# Altium schematic sheet Analog_Interface.SchDoc
size C; SheetNumber: 3; SheetTotal: 8
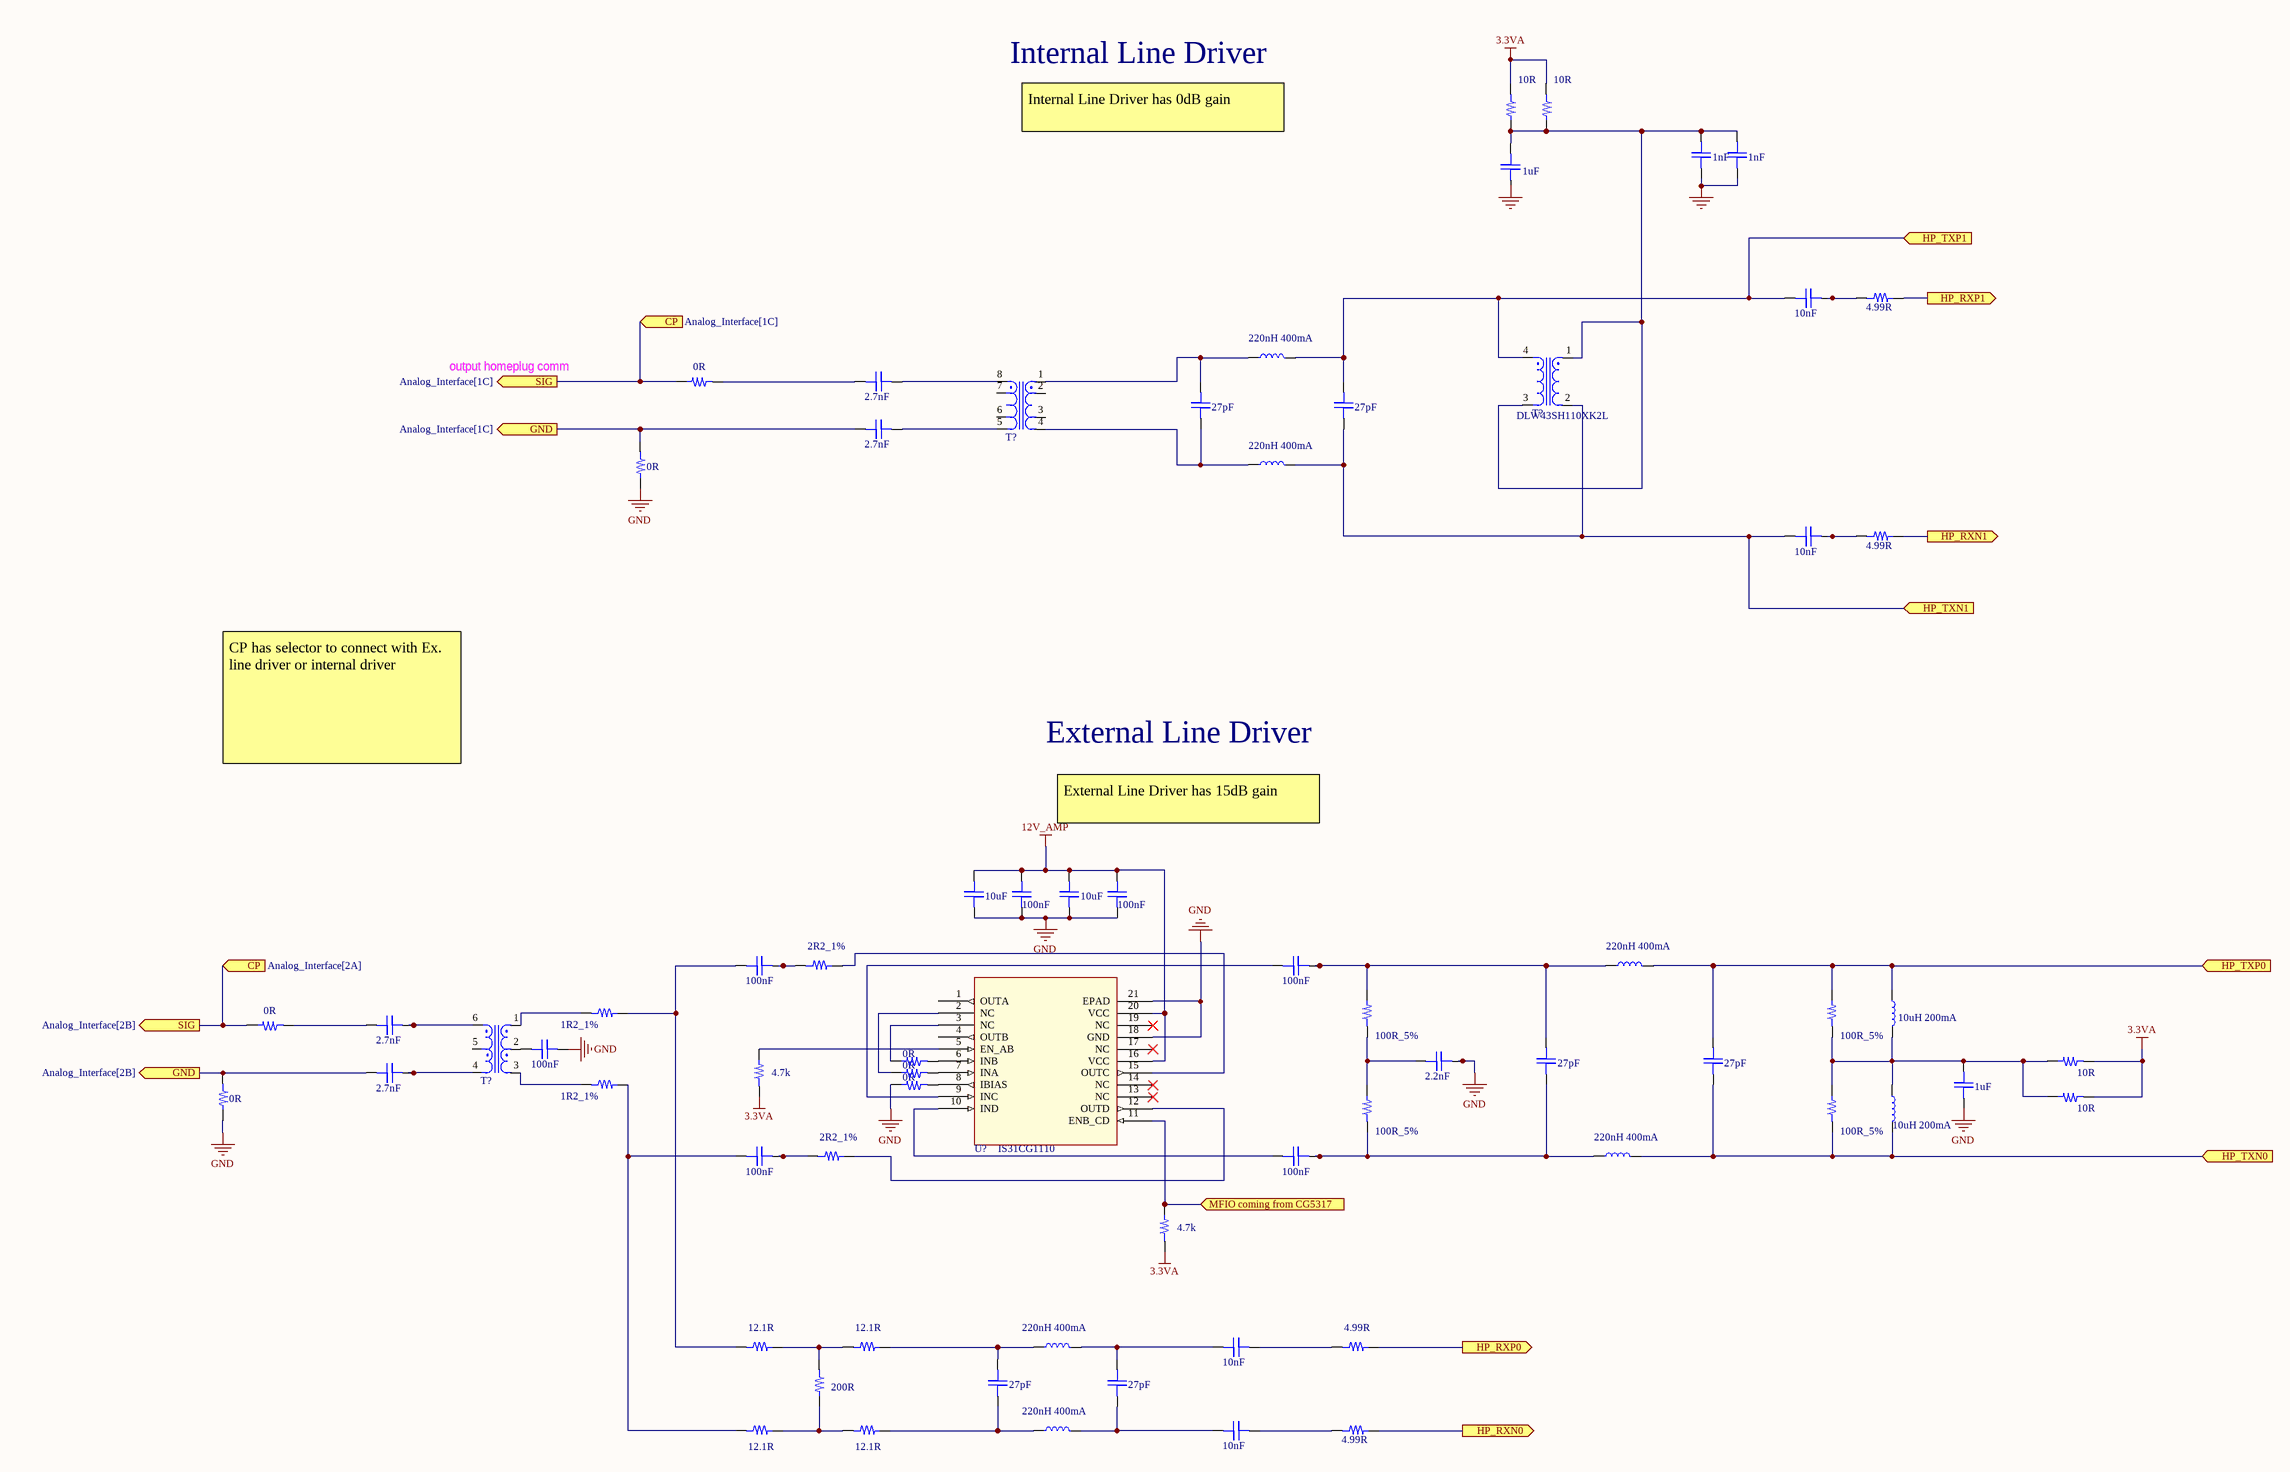
[diagram p0: Analog_Interface.SchDoc]

## Parts
(Parts that share a designator on the sheet are numbered #1, #2 ... from top to bottom, then left to right.)
?#1  10uH 200mA  [L_0805]
?#2  10uH 200mA  [L_0805]
C?#1  1nF  [C0402]
C?#2  1nF  [C0402]
C?#3  1uF  [C0402]
C?#4  10nF  [C0402]
C?#5  2.7nF  [C0402]
C?#6  2.7nF  [C0402]
C?#7  27pF  [C0402]
C?#8  27pF  [C0402]
C?#9  10nF  [C0402]
C?#10  value 10uF  [C0402]  (hidden comment: Capacitor)
C?#11  value 100nF  [C0402]  (hidden comment: Capacitor)
C?#12  value 10uF  [C0402]  (hidden comment: Capacitor)
C?#13  value 100nF  [C0402]  (hidden comment: Capacitor)
C?#14  100nF  [C0402]
C?#15  100nF  [C0402]
C?#16  2.7nF  [C0402]
C?#17  value 100nF  [C0402]  (hidden comment: Capacitor)
C?#18  2.2nF  [C0402]
C?#19  1uF  [C0402]
C?#20  2.7nF  [C0402]
C?#21  27pF  [C0402]
C?#22  27pF  [C0402]
C?#23  100nF  [C0402]
C?#24  100nF  [C0402]
C?#25  10nF  [C0402]
C?#26  27pF  [C0402]
C?#27  27pF  [C0402]
C?#28  10nF  [C0402]
L?#1  220nH 400mA  [L_0805]
L?#2  220nH 400mA  [L_0805]
L?#3  220nH 400mA  [L_0805]
L?#4  220nH 400mA  [L_0805]
L?#5  220nH 400mA  [L_0805]
L?#6  220nH 400mA  [L_0805]
R?#1  10R  [R0402]
R?#2  10R  [R0402]
R?#3  4.99R  [R0402]
R?#4  value 0R  [R0402]  (hidden comment: Resistor)
R?#5  value 0R  [R0402]  (hidden comment: Resistor)
R?#6  4.99R  [R0402]
R?#7  2R2_1%  [R0402]
R?#8  1R2_1%  [R0402]
R?#9  value 0R  [R0402]  (hidden comment: Resistor)
R?#10  100R_5%  [R0402]
R?#11  100R_5%  [R0402]
R?#12  value 0R  [R0402]  (hidden comment: Resistor)
R?#13  10R  [R0402]
R?#14  value 0R  [R0402]  (hidden comment: Resistor)
R?#15  value 0R  [R0402]  (hidden comment: Resistor)
R?#16  1R2_1%  [R0402]
R?#17  value 0R  [R0402]  (hidden comment: Resistor)
R?#18  value 4.7k  [R0402]  (hidden comment: Resistor)
R?#19  10R  [R0402]
R?#20  100R_5%  [R0402]
R?#21  100R_5%  [R0402]
R?#22  2R2_1%  [R0402]
R?#23  value 4.7k  [R0402]  (hidden comment: Resistor)
R?#24  12.1R  [R0402]
R?#25  12.1R  [R0402]
R?#26  4.99R  [R0402]
R?#27  200R  [R0402]
R?#28  12.1R  [R0402]
R?#29  12.1R  [R0402]
R?#30  4.99R  [R0402]
T?#1  DLW43SH110XK2L
T?#2  Transformer  (value not drawn)
T?#3  Transformer  (value not drawn)
U?  value IS31CG1110  [QFLS2]  (hidden comment: ISSI Line Driver IC)

## Ports
CP (in, see Analog_Interface[1C]), CP (in, see Analog_Interface[2A]), GND (out, see Analog_Interface[1C]), GND (out, see Analog_Interface[2B]), HP_RXN0 (out, see PLC[5B]), HP_RXN1 (out, see PLC[5B]), HP_RXP0 (out, see PLC[5B]), HP_RXP1 (out, see PLC[5B]), HP_TXN0 (in, see PLC[5B]), HP_TXN1 (in, see PLC[5B]), HP_TXP0 (in, see PLC[5B]), HP_TXP1 (in, see PLC[5B]), MFIO coming from CG5317 (in), SIG (out, see Analog_Interface[1C]), SIG (out, see Analog_Interface[2B])

## Nets
3.3VA: R?#1.1 R?#2.1 R?#13.1 R?#18.1 R?#19.1 R?#23.1
12V_AMP: C?#10.1 C?#11.1 C?#12.1 C?#13.1 U?.16(VCC) U?.20(VCC)
GND: C?#1.1 C?#2.1 C?#10.1 C?#11.1 C?#12.1 C?#13.1 C?#17.1 C?#18.1 C?#19.1 R?#5.1 R?#14.1 R?#17.1 U?.18(GND) U?.21(EPAD)
CP: R?#4.1 R?#9.1 ; port SIG, port CP
GND: C?#6.1 C?#20.1 R?#5.1 R?#14.1 ; port GND  [a separate net that carries the same name]
HP_RXN0: R?#30.1 ; port HP_RXN0
HP_RXN1: R?#6.1 ; port HP_RXN1
HP_RXP0: R?#26.1 ; port HP_RXP0
HP_RXP1: R?#3.1 ; port HP_RXP1
HP_TXN0: ?#2.2 C?#22.1 L?#4.2 R?#21.1 ; port HP_TXN0
HP_TXN1: C?#8.1 C?#9.1 L?#2.2 T?#1.2 ; port HP_TXN1
HP_TXP0: ?#1.1 C?#22.1 L?#3.2 R?#11.1 ; port HP_TXP0
HP_TXP1: C?#4.1 C?#8.1 L?#1.2 T?#1.4 ; port HP_TXP1
MFIO coming from CG5317: R?#23.1 U?.11(ENB_CD) ; port MFIO coming from CG5317
Net?#1_2: ?#1.2 ?#2.1 C?#19.1 R?#11.1 R?#13.1 R?#19.1 R?#21.1
NetC?#1_1: C?#1.1 C?#2.1 C?#3.1 R?#1.1 R?#2.1 T?#1.1 T?#1.3
NetC?#4_1: C?#4.1 R?#3.1
NetC?#5_1: C?#5.1 T?#2.8
NetC?#5_1: C?#5.1 R?#4.1  [a separate net that carries the same name]
NetC?#6_1: C?#6.1 T?#2.5
NetC?#7_1: C?#7.1 L?#1.1 T?#2.1
NetC?#7_1: C?#7.1 L?#2.1 T?#2.4  [a separate net that carries the same name]
NetC?#9_1: C?#9.1 R?#6.1
NetC?#14_1: C?#14.1 R?#8.1 R?#24.1
NetC?#14_1: C?#14.1 R?#7.1  [a separate net that carries the same name]
NetC?#15_1: C?#15.1 C?#21.1 L?#3.1 R?#10.1
NetC?#15_1: C?#15.1 U?.9(INC)  [a separate net that carries the same name]
NetC?#16_1: C?#16.1 T?#3.6
NetC?#16_1: C?#16.1 R?#9.1  [a separate net that carries the same name]
NetC?#17_1: C?#17.1 T?#3.2
NetC?#18_1: C?#18.1 R?#10.1 R?#20.1
NetC?#20_1: C?#20.1 T?#3.4
NetC?#21_1: C?#21.1 C?#24.1 L?#4.1 R?#20.1
NetC?#23_1: C?#23.1 R?#16.1 R?#28.1
NetC?#23_1: C?#23.1 R?#22.1  [a separate net that carries the same name]
NetC?#24_1: C?#24.1 U?.10(IND)
NetC?#25_1: C?#25.1 C?#27.1 L?#5.2
NetC?#25_1: C?#25.1 R?#26.1  [a separate net that carries the same name]
NetC?#26_1: C?#26.1 L?#5.1 R?#25.1
NetC?#26_1: C?#26.1 L?#6.1 R?#29.1  [a separate net that carries the same name]
NetC?#27_1: C?#27.1 C?#28.1 L?#6.2
NetC?#28_1: C?#28.1 R?#30.1
NetR?#7_1: R?#7.1 U?.15(OUTC)
NetR?#8_1: R?#8.1 T?#3.1
NetR?#12_1: R?#12.1 U?.3(NC)
NetR?#12_1: R?#12.1 U?.6(INB)  [a separate net that carries the same name]
NetR?#15_1: R?#15.1 U?.2(NC)
NetR?#15_1: R?#15.1 U?.7(INA)  [a separate net that carries the same name]
NetR?#16_1: R?#16.1 T?#3.3
NetR?#17_1: R?#17.1 U?.8(IBIAS)
NetR?#18_1: R?#18.1 U?.5(EN_AB)
NetR?#22_1: R?#22.1 U?.12(OUTD)
NetR?#24_1: R?#24.1 R?#25.1 R?#27.1
NetR?#27_1: R?#27.1 R?#28.1 R?#29.1

Not connected (* = marked no-connect by the designer): T?#2 2 3 6 7; T?#3 5; U? 1(OUTA) 4(OUTB) 13(NC)* 14(NC)* 17(NC)* 19(NC)*

## Notes on the sheet
- Internal Line Driver
- Internal Line Driver has 0dB gain
- output homeplug comm signal
- CP has selector to connect with Ex. line driver or internal driver
- External Line Driver
- External Line Driver has 15dB gain
- Labels drawn without touching a wire or pin: GND

## Library data of the parts
?#1 ?#2 L?#1-L?#6 = Inductor_SMT: ComponentLink1Description: New link
C?#1-C?#28 = CAP_SMT: ComponentLink1Description: New link
R?#1-R?#30 = RES_SMT: ComponentLink1Description: New link; ComponentLink1URL: *
T?#1 = Transformer 4 pins: ComponentLink1Description: New link
T?#2 = Transformer 8 pin: ComponentLink1Description: New link
T?#3 = Transformer 6 pin: ComponentLink1Description: New link
U? = IS31CG1110: Buffers & Line Drivers High-performance MIMO/SISO dual port differential line driver designed to work in broadband PLC system; ComponentLink1Description: New link